# Altium schematic sheet power.SchDoc
size A4
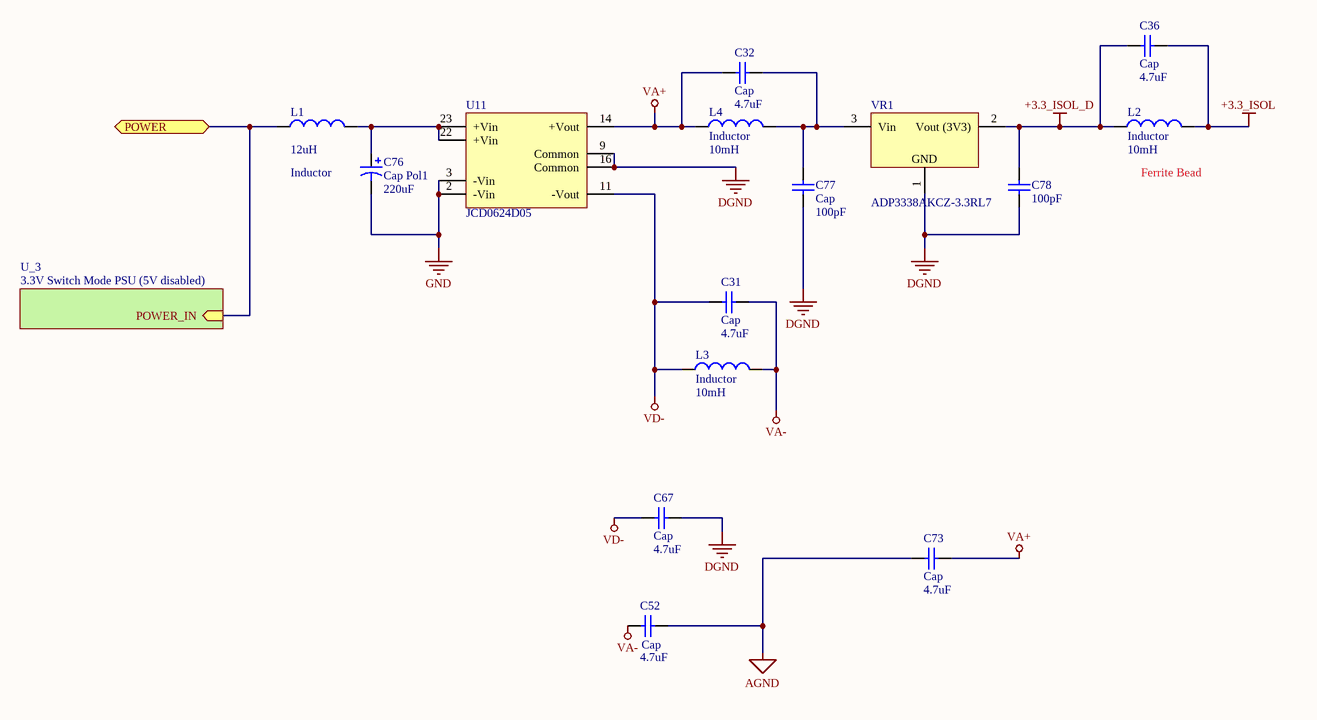
[diagram p0: power.SchDoc]

## Parts
C31  Cap  value 4.7uF  [C0603]
C32  Cap  value 4.7uF  [C0603]
C36  Cap  value 4.7uF  [C0603]
C52  Cap  value 4.7uF  [C0603]
C67  Cap  value 4.7uF  [C0603]
C73  Cap  value 4.7uF  [C0603]
C76  Cap Pol1  value 220uF  [Capacitor]
C77  Cap  value 100pF  [C0805]
C78  value 100pF  [C0805]  (hidden comment: Cap)
L1  Inductor  value 12uH  [SDR0604-150YL]
L2  Inductor  value 10mH  [C0805]
L3  Inductor  value 10mH  [C0805]
L4  Inductor  value 10mH  [C0805]
U11  JCD0624D05  [DIP24]
VR1  ADP3338AKCZ-3.3RL7  [ADP3338AKCZ-3.3RL7]

## Sub-sheets
U_3 = 3.3V Switch Mode PSU (5V disabled): POWER_IN (in)

## Ports
POWER

## Nets
+3.3_ISOL: C36.2 L2.2
+3.3_ISOL_D: C36.1 C78.1 L2.1 VR1.2(Vout_(3V3))
AGND: C52.2 C73.1
DGND: C67.2 C77.1 C78.2 U11.9(Common) U11.16(Common) VR1.1(GND)
GND: C76.2 U11.2(-Vin) U11.3(-Vin)
VA+: C32.1 C73.2 L4.1 U11.14(+Vout)
VA-: C31.2 C52.1 L3.2
VD-: C31.1 C67.1 L3.1 U11.11(-Vout)
POWER: L1.1 ; port POWER, sheet U_3/POWER_IN
NetC32_2: C32.2 C77.2 L4.2 VR1.3(Vin)
NetC76_1: C76.1 L1.2 U11.22(+Vin) U11.23(+Vin)

## Notes on the sheet
- (near L2) Ferrite Bead

## Library data of the parts
C31 C32 C36 C52 C67 C73 C77 C78 = Cap: Capacitor; Published: 8-Jun-2000; LatestRevisionDate: 17-Jul-2002; LatestRevisionNote: Re-released for DXP Platform.; PackageReference: RAD-0.3; Publisher: Altium Limited
C76 = Cap Pol1: Polarized Capacitor (Radial); Published: 8-Jun-2000; LatestRevisionDate: 17-Jul-2002; LatestRevisionNote: Re-released for DXP Platform.; PackageReference: RB7.6-15; Publisher: Altium Limited; farnell: 1831303
L1-L4 = Inductor: Code_IEC: 1005; Published: 8-Jun-2000; LatestRevisionDate: 29-May-2009; LatestRevisionNote: IPC-7351 Footprint Added.; PackageReference: 0402-A; Publisher: Altium Limited; PackageDescription: Chip Inductor; Code_JEITA: 0402
  L1: farnell: 744773112
U11 = JCD0624D05: DC/DC CONVERTER, 6W, +/-5V, DIP-24; farnell: 2065315
VR1 = ADP3338AKCZ-3.3RL7: 3.3V LDO Regulator; farnell: 1651283